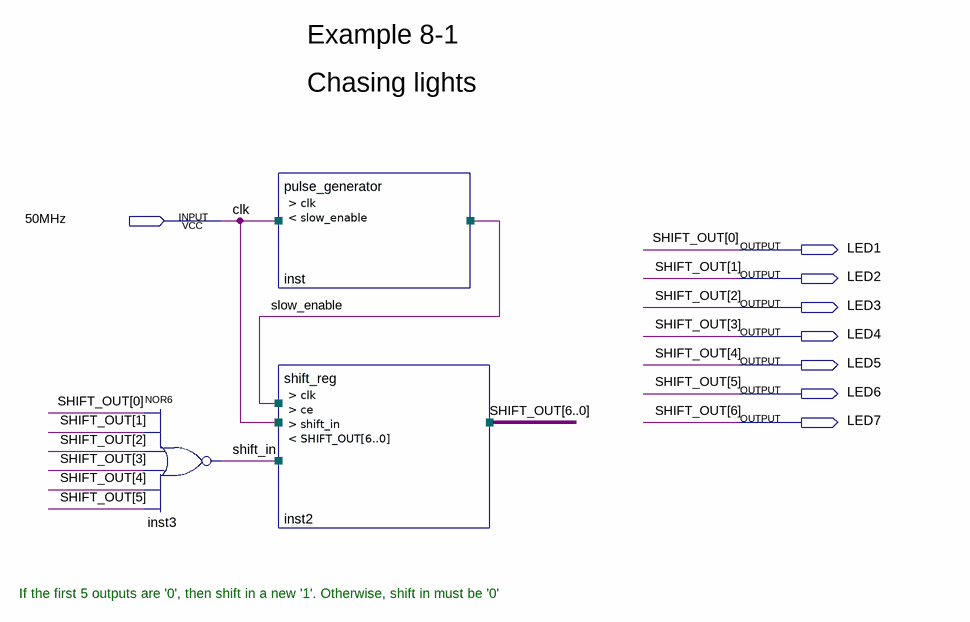
[diagram p0: schematic sheet]
// Quartus schematic ex8_1.bdf as structural Verilog: 3 symbols, 8 pins
module ex8_1 (
  input  \50MHz ,
  output LED1,
  output LED2,
  output LED3,
  output LED4,
  output LED5,
  output LED6,
  output LED7
);

  wire shift_in, slow_enable;

  nor inst3 (shift_in, LED1, LED2, LED3, LED4, LED5, LED6);
  pulse_generator inst (.clk(\50MHz ), .slow_enable(slow_enable));
  shift_reg inst2 (
    .clk(\50MHz ), .ce(slow_enable), .shift_in(shift_in),
    .SHIFT_OUT({LED7, LED6, LED5, LED4, LED3, LED2, LED1}));

  // Other names for the same wires on the sheet: clk = \50MHz ;
  //   SHIFT_OUT[6:0] = {LED7, LED6, LED5, LED4, LED3, LED2, LED1}

  // Notes on the sheet:
  //   Example 8-1
  //   Chasing lights
  //   If the first 5 outputs are '0', then shift in a new '1'. Otherwise, shift in must be '0'
endmodule
